# Altium schematic sheet STM32WB55 Sensor MCU.SchDoc
size A3; SheetNumber: 6; SheetTotal: 7
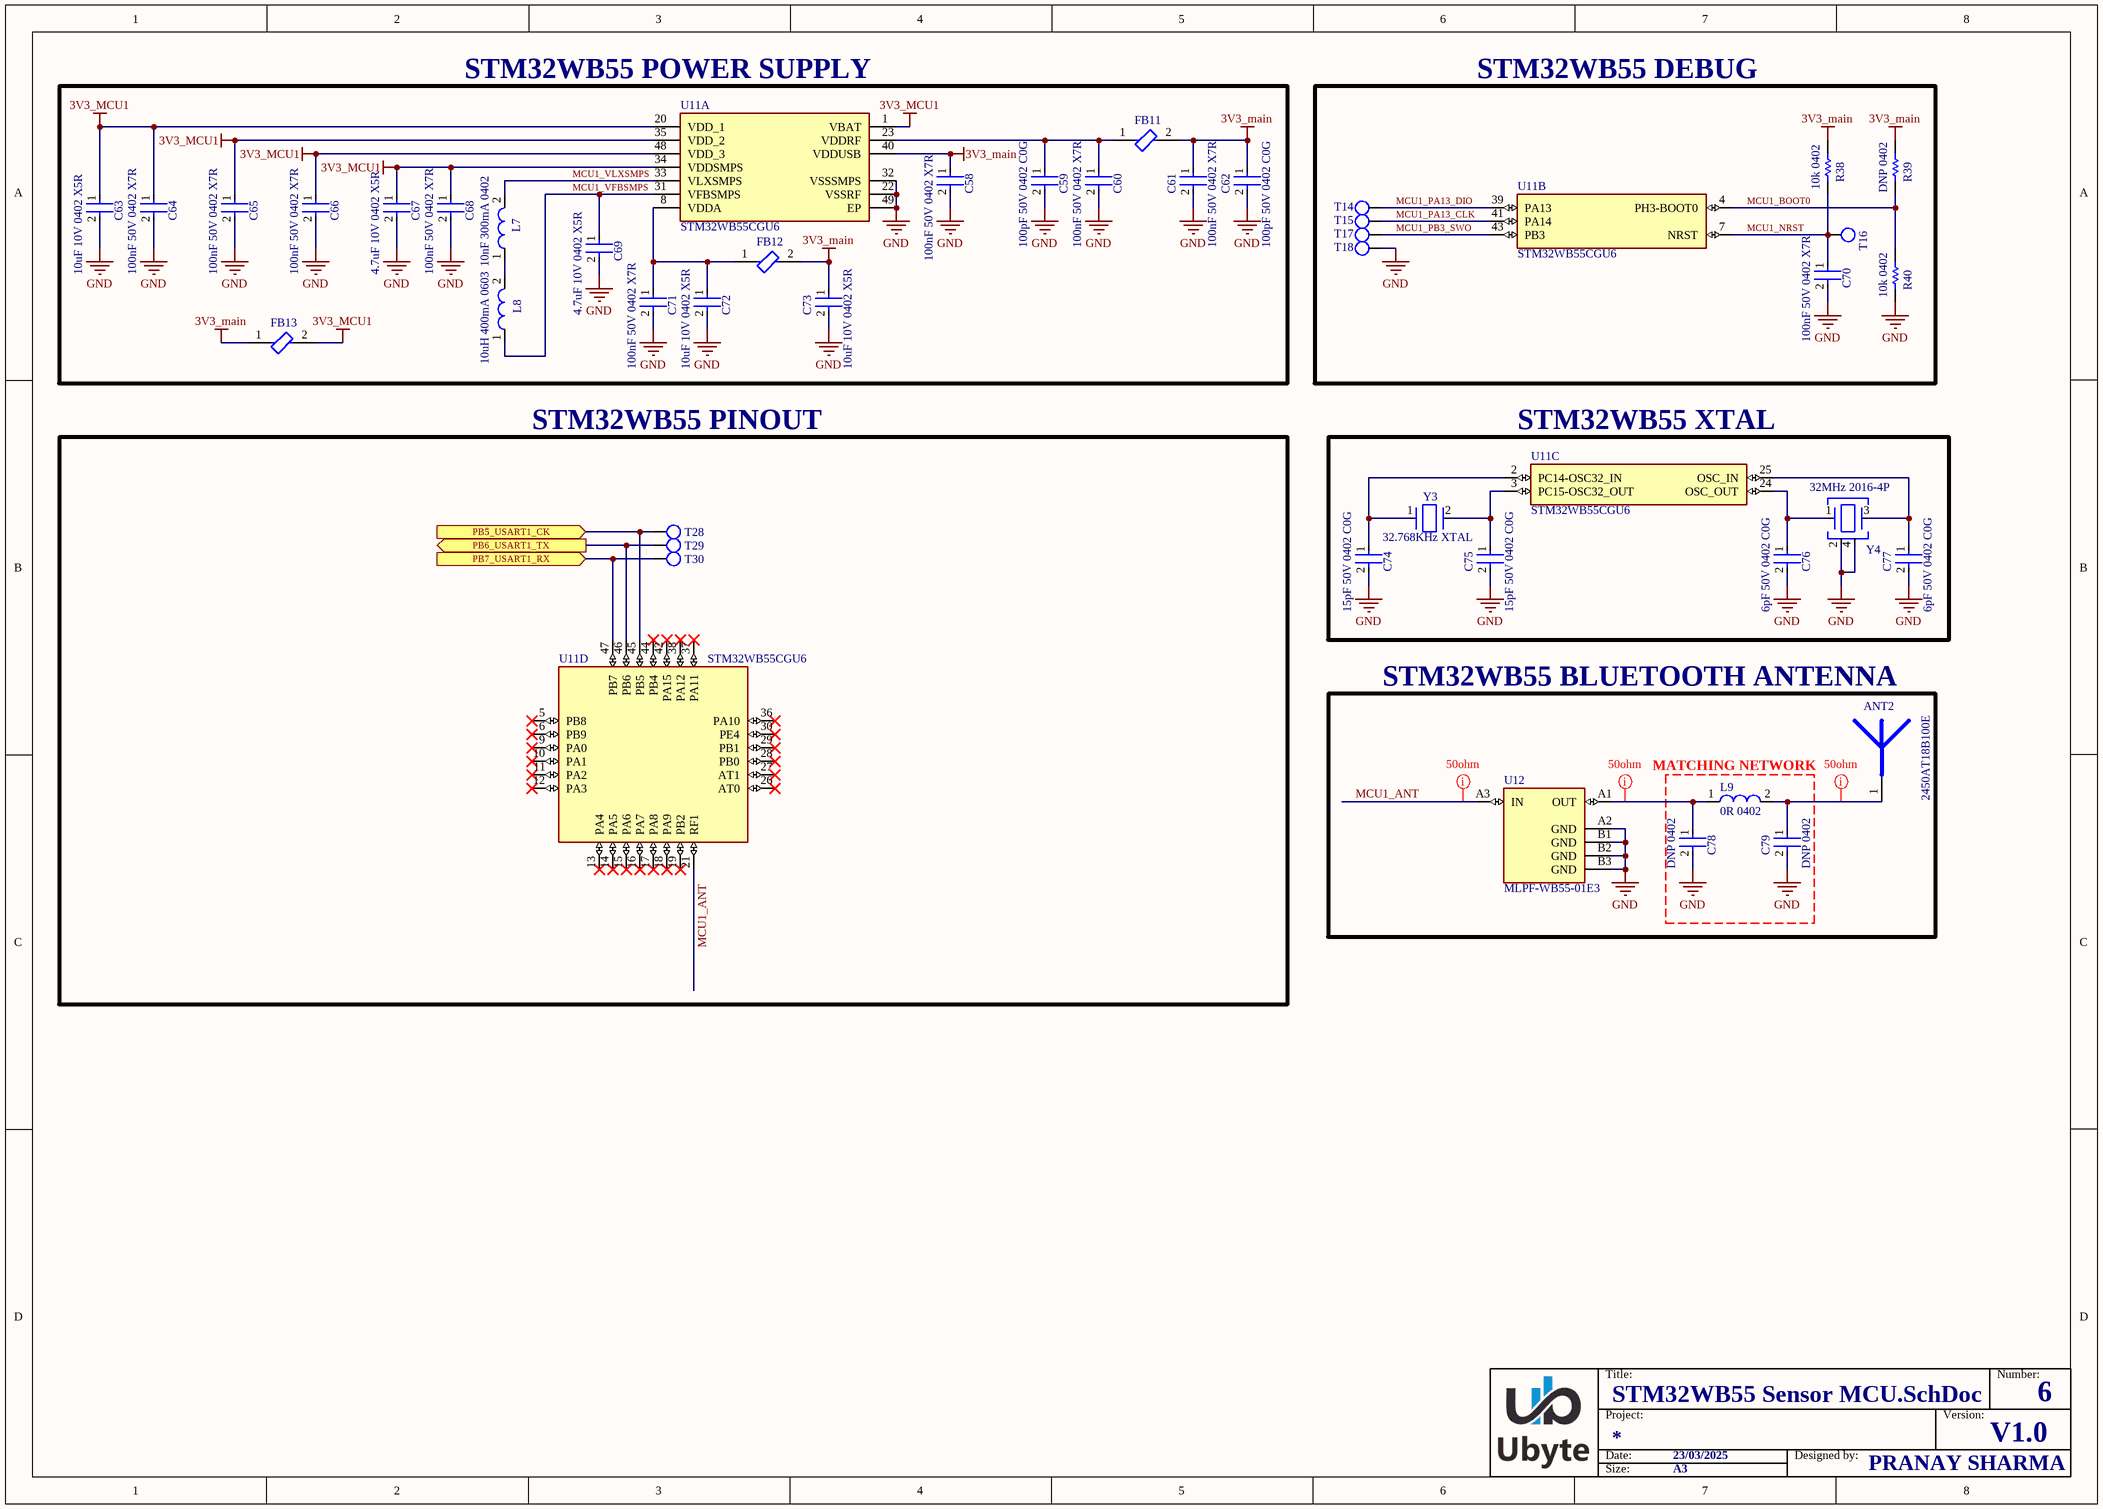
[diagram p0: STM32WB55 Sensor MCU.SchDoc]

## Parts
ANT2  2450AT18B100E  [2450AT18B100E IPC-C]
C58  100nF 50V 0402 X7R  [0402 IPC CLASS C CAPACITOR]
C59  100pF 50V 0402 C0G  [0402 IPC CLASS C CAPACITOR]
C60  100nF 50V 0402 X7R  [0402 IPC CLASS C CAPACITOR]
C61  100nF 50V 0402 X7R  [0402 IPC CLASS C CAPACITOR]
C62  100pF 50V 0402 C0G  [0402 IPC CLASS C CAPACITOR]
C63  10uF 10V 0402 X5R  [0402 IPC CLASS C CAPACITOR]
C64  100nF 50V 0402 X7R  [0402 IPC CLASS C CAPACITOR]
C65  100nF 50V 0402 X7R  [0402 IPC CLASS C CAPACITOR]
C66  100nF 50V 0402 X7R  [0402 IPC CLASS C CAPACITOR]
C67  4.7uF 10V 0402 X5R  [0402 IPC CLASS C CAPACITOR]
C68  100nF 50V 0402 X7R  [0402 IPC CLASS C CAPACITOR]
C69  4.7uF 10V 0402 X5R  [0402 IPC CLASS C CAPACITOR]
C70  100nF 50V 0402 X7R  [0402 IPC CLASS C CAPACITOR]
C71  100nF 50V 0402 X7R  [0402 IPC CLASS C CAPACITOR]
C72  10uF 10V 0402 X5R  [0402 IPC CLASS C CAPACITOR]
C73  10uF 10V 0402 X5R  [0402 IPC CLASS C CAPACITOR]
C74  15pF 50V 0402 C0G  [0402 IPC CLASS C CAPACITOR]
C75  15pF 50V 0402 C0G  [0402 IPC CLASS C CAPACITOR]
C76  6pF 50V 0402 C0G  [0402 IPC CLASS C CAPACITOR]
C77  6pF 50V 0402 C0G  [0402 IPC CLASS C CAPACITOR]
C78  DNP 0402  [0402 IPC CLASS C CAPACITOR]
C79  DNP 0402  [0402 IPC CLASS C CAPACITOR]
FB11  BLM15AX102SN1D  [0402 IPC CLASS C FERRITE BEAD]  (value not drawn)
FB12  BLM15AX102SN1D  [0402 IPC CLASS C FERRITE BEAD]  (value not drawn)
FB13  BLM15AX102SN1D  [0402 IPC CLASS C FERRITE BEAD]  (value not drawn)
L7  10nF 300mA 0402  [0402 IPC CLASS C FERRITE BEAD]
L8  10uH 400mA 0603  [0603 IPC CLASS C INDUCTOR]
L9  0R 0402  [0402 IPC CLASS C FERRITE BEAD]
R38  10k 0402  [0402 IPC CLASS C RESISTOR]
R39  DNP 0402  [0402 IPC CLASS C RESISTOR]  (no BOM)
R40  10k 0402  [0402 IPC CLASS C RESISTOR]
T14  Test Point TH  [Test Point TH]  (value not drawn)  (no BOM)
T15  Test Point TH  [Test Point TH]  (value not drawn)  (no BOM)
T16  Test Point TH  [Test Point TH]  (value not drawn)  (no BOM)
T17  Test Point TH  [Test Point TH]  (value not drawn)  (no BOM)
T18  Test Point TH  [Test Point TH]  (value not drawn)  (no BOM)
T28  TP  [Testpoint1]  (value not drawn)  (no BOM)
T29  TP  [Testpoint1]  (value not drawn)  (no BOM)
T30  TP  [Testpoint1]  (value not drawn)  (no BOM)
U11  STM32WB55CGU6  [UFQFPN48 IPC-C]  (parts A,B,C,D of 4)
U12  MLPF-WB55-01E3  [MLPF-WB55-01E3]
Y3  32.768KHz XTAL  [SMD3215-2P IPC-C]
Y4  32MHz 2016-4P  [SMD2016-4P IPC-C]

## Blocks framed on the sheet
STM32WB55 POWER SUPPLY: C58-C69 C71-C73 FB11-FB13 L7 L8 U11
STM32WB55 DEBUG: C70 R38-R40 T14-T18 U11
STM32WB55 PINOUT: T28-T30 U11
STM32WB55 XTAL: C74-C77 U11 Y3 Y4
STM32WB55 BLUETOOTH ANTENNA: ANT2 C78 C79 L9 U12

## Ports
PB5_USART1_CK (in), PB6_USART1_TX (out), PB7_USART1_RX (in)

## Nets
3V3_main: C58.1 C61.1 C62.1 C73.1 FB11.2 FB12.2 FB13.1 R38.2 R39.2 U11.40(VDDUSB)
3V3_MCU1: C63.1 C64.1 C65.1 C66.1 C67.1 C68.1 FB13.2 U11.1(VBAT) U11.20(VDD_1) U11.34(VDDSMPS) U11.35(VDD_2) U11.48(VDD_3)
GND: C58.2 C59.2 C60.2 C61.2 C62.2 C63.2 C64.2 C65.2 C66.2 C67.2 C68.2 C69.2 C70.2 C71.2 C72.2 C73.2 C74.2 C75.2 C76.2 C77.2 C78.2 C79.2 R40.1 T18.0 U11.22(VSSRF) U11.32(VSSSMPS) U11.49(EP) U12.A2(GND) U12.B1(GND) U12.B2(GND) U12.B3(GND) Y4.2 Y4.4
MCU1_ANT: U11.21(RF1) U12.A3(IN)
MCU1_BOOT0: R39.1 R40.2 U11.4(PH3-BOOT0)
MCU1_NRST: C70.1 R38.1 T16.0 U11.7(NRST)
MCU1_PA13_CLK: T15.0 U11.41(PA14)
MCU1_PA13_DIO: T14.0 U11.39(PA13)
MCU1_PB3_SWO: T17.0 U11.43(PB3)
MCU1_VFBSMPS: C69.1 L8.1 U11.31(VFBSMPS)
MCU1_VLXSMPS: L7.2 U11.33(VLXSMPS)
PB5_USART1_CK: T28.0 U11.45(PB5) ; port PB5_USART1_CK
PB6_USART1_TX: T29.0 U11.46(PB6) ; port PB6_USART1_TX
PB7_USART1_RX: T30.0 U11.47(PB7) ; port PB7_USART1_RX
NetANT2_1: ANT2.1 C79.1 L9.2
NetC59_1: C59.1 C60.1 FB11.1 U11.23(VDDRF)
NetC71_1: C71.1 C72.1 FB12.1 U11.8(VDDA)
NetC74_1: C74.1 U11.2(PC14-OSC32_IN) Y3.1
NetC75_1: C75.1 U11.3(PC15-OSC32_OUT) Y3.2
NetC76_1: C76.1 U11.24(OSC_OUT) Y4.1
NetC77_1: C77.1 U11.25(OSC_IN) Y4.3
NetC78_1: C78.1 L9.1 U12.A1(OUT)
NetL7_1: L7.1 L8.2

Not connected (* = marked no-connect by the designer): U11 5(PB8)* 6(PB9)* 9(PA0)* 10(PA1)* 11(PA2)* 12(PA3)* 13(PA4)* 14(PA5)* 15(PA6)* 16(PA7)* 17(PA8)* 18(PA9)* 19(PB2)* 26(AT0)* 27(AT1)* 28(PB0)* 29(PB1)* 30(PE4)* 36(PA10)* 37(PA11)* 38(PA12)* 42(PA15)* 44(PB4)*

## Layout directives
net class 50ohm: MCU1_ANT, NetANT2_1, NetC78_1

## Notes on the sheet
- (near L9) MATCHING NETWORK
- Title:
- Number:
- Date:
- Project:
- 23/03/2025
- Designed by:
- Version:
- V1.0
- Size:
- A3
- PRANAY SHARMA

## Library data of the parts
C78 C79 = 100nF 50V 0402 X7R
L7 L9 = SDCL1005C10NJTDF
L8 = MGFL1608F100MT-LF
R38 R40 = 10k 1% 0402
R39 = 0R 1% 0402
T28-T30 = Testpoint1
Y3 = H31003271C2070CY